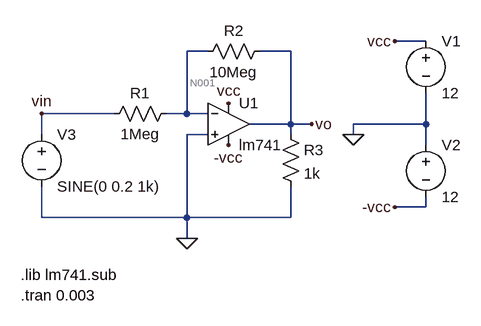
[diagram p0: schematic OPAMP.asc]
OPAMP.asc, the LTspice schematic file:
Version 4
SHEET 1 1112 680
WIRE 480 32 432 32
WIRE 144 48 112 48
WIRE 272 48 224 48
WIRE 0 144 -112 144
WIRE 112 144 112 48
WIRE 112 144 80 144
WIRE 144 144 112 144
WIRE 272 160 272 48
WIRE 272 160 208 160
WIRE 304 160 272 160
WIRE 480 160 480 112
WIRE 480 160 368 160
WIRE -112 176 -112 144
WIRE 144 176 112 176
WIRE 272 176 272 160
WIRE 368 176 368 160
WIRE 480 192 480 160
WIRE 480 288 480 272
WIRE 480 288 432 288
WIRE -112 304 -112 256
WIRE 112 304 112 176
WIRE 112 304 -112 304
WIRE 272 304 272 256
WIRE 272 304 112 304
WIRE 112 336 112 304
FLAG 368 176 0
FLAG 432 32 vcc
FLAG 432 288 -vcc
FLAG 176 192 -vcc
FLAG 176 128 vcc
FLAG 112 336 0
FLAG 304 160 vo
FLAG -112 144 vin
SYMBOL res 96 128 R90
WINDOW 0 0 56 VBottom 2
WINDOW 3 32 56 VTop 2
SYMATTR InstName R1
SYMATTR Value 1Meg
SYMBOL res 240 32 R90
WINDOW 0 0 56 VBottom 2
WINDOW 3 32 56 VTop 2
SYMATTR InstName R2
SYMATTR Value 10Meg
SYMBOL voltage 480 16 R0
SYMATTR InstName V1
SYMATTR Value 12
SYMBOL voltage 480 176 R0
SYMATTR InstName V2
SYMATTR Value 12
SYMBOL voltage -112 160 R0
WINDOW 123 0 0 Left 0
WINDOW 39 0 0 Left 0
SYMATTR InstName V3
SYMATTR Value SINE(0 0.2 1k)
SYMBOL res 256 160 R0
SYMATTR InstName R3
SYMATTR Value 1k
SYMBOL OpAmps\\opamp2 176 96 R0
SYMATTR InstName U1
SYMATTR Value lm741
SYMATTR SpiceModel lm741
TEXT -144 392 Left 2 !.lib lm741.sub
TEXT -144 424 Left 2 !.tran 0.003

The netlist it stands for:
* OPAMP.asc
R1 N001 vin 1Meg
R2 vo N001 10Meg
V1 vcc 0 12
V2 0 -vcc 12
V3 vin 0 SINE(0 0.2 1k)
R3 vo 0 1k
XU1 0 N001 vcc -vcc vo lm741 lm741  ; pins In+ In- V+ V- OUT
.lib lm741.sub
.tran 0.003
.backanno
.end

* Results of the author's LTspice run, read from the files saved beside the schematic
* Operating Point, zero values left out:
*   V(n001) = 1.994 mV
*   V(vo) = 1.02 V
*   V(vcc) = 12 V
*   V(-vcc) = -12 V
*   I(R1) = 1.994 nA
*   I(R2) = 101.8 nA
*   I(R3) = 1.02 mA
*   I(V1) = -2.573 mA
*   I(V2) = -1.552 mA
*   I(V3) = 1.994 nA
*   Ix(u1:1) = 59.88 nA
*   Ix(u1:2) = 99.84 nA
*   Ix(u1:99) = 2.573 mA
*   Ix(u1:50) = -1.552 mA
*   Ix(u1:28) = -1.02 mA
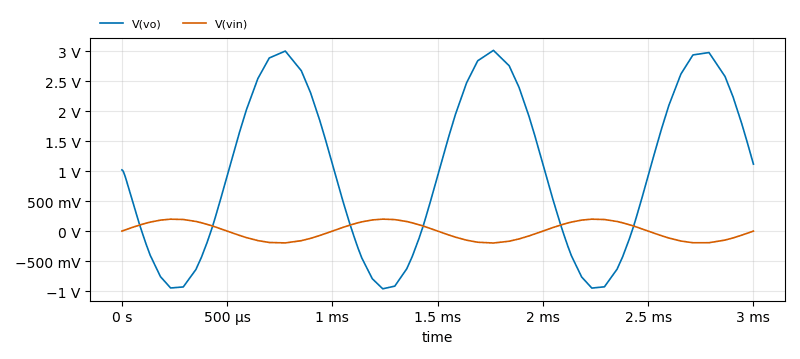
[diagram p1: Transient Analysis of OPAMP.asc, plotted from the saved traces]
* Transient Analysis, 1 run:
*   V(vo): min -962.9 mV, max 3.015 V, average 1.016 V, rms 1.732 V, last 1.117 V
*   V(vin): min -199.1 mV, max 199.5 mV, average 379.9 µV, rms 140.4 mV, last 0 V